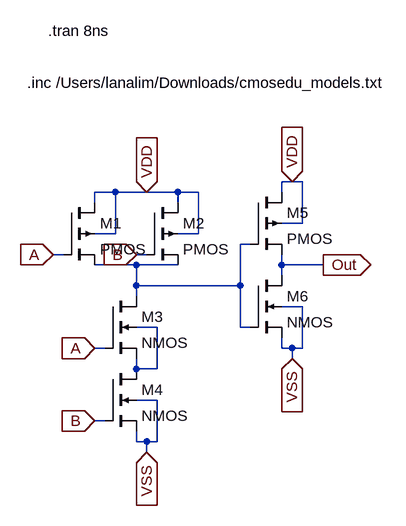
[diagram p0: schematic cmos_and.asc]
cmos_and.asc, the LTspice schematic file:
Version 4
SHEET 1 1408 680
WIRE 608 144 592 144
WIRE 624 144 608 144
WIRE 336 160 304 160
WIRE 384 160 336 160
WIRE 432 160 384 160
WIRE 464 160 432 160
WIRE 592 160 592 144
WIRE 304 176 304 160
WIRE 432 176 432 160
WIRE 624 208 624 144
WIRE 624 208 592 208
WIRE 336 224 336 160
WIRE 336 224 304 224
WIRE 464 224 464 160
WIRE 464 224 432 224
WIRE 544 240 528 240
WIRE 256 256 240 256
WIRE 384 256 368 256
WIRE 368 272 304 272
WIRE 432 272 368 272
WIRE 592 272 592 256
WIRE 656 272 592 272
WIRE 592 288 592 272
WIRE 368 304 368 272
WIRE 528 304 528 240
WIRE 528 304 368 304
WIRE 368 320 368 304
WIRE 624 336 592 336
WIRE 400 368 368 368
WIRE 528 368 528 304
WIRE 544 368 528 368
WIRE 320 400 304 400
WIRE 592 400 592 384
WIRE 608 400 592 400
WIRE 624 400 624 336
WIRE 624 400 608 400
WIRE 608 416 608 400
WIRE 368 432 368 416
WIRE 400 432 400 368
WIRE 400 432 368 432
WIRE 400 480 368 480
WIRE 320 512 304 512
WIRE 368 544 368 528
WIRE 384 544 368 544
WIRE 400 544 400 480
WIRE 400 544 384 544
WIRE 384 560 384 544
FLAG 384 160 VDD
IOPIN 384 160 In
FLAG 240 256 A
IOPIN 240 256 In
FLAG 368 256 B
IOPIN 368 256 In
FLAG 304 400 A
IOPIN 304 400 In
FLAG 304 512 B
IOPIN 304 512 In
FLAG 384 560 VSS
IOPIN 384 560 In
FLAG 608 416 VSS
IOPIN 608 416 In
FLAG 608 144 VDD
IOPIN 608 144 In
FLAG 656 272 Out
IOPIN 656 272 Out
SYMBOL pmos4 256 176 R0
SYMATTR InstName M1
SYMATTR Value2 l=1e-7 w=3e-7
SYMBOL pmos4 384 176 R0
SYMATTR InstName M2
SYMATTR Value2 l=1e-7 w=3e-7
SYMBOL nmos4 320 320 R0
SYMATTR InstName M3
SYMATTR Value2 l=1e-7 w=4e-7
SYMBOL nmos4 320 432 R0
SYMATTR InstName M4
SYMATTR Value2 l=1e-7 w=4e-7
SYMBOL pmos4 544 160 R0
SYMATTR InstName M5
SYMATTR Value2 l=1e-7 w=3e-7
SYMBOL nmos4 544 288 R0
SYMATTR InstName M6
SYMATTR Value2 l=1e-7 w=2e-7
TEXT 200 -8 Left 2 !.inc /Users/lanalim/Downloads/cmosedu_models.txt
TEXT 232 -88 Left 2 !.tran 8ns

The netlist it stands for:
* cmos_and.asc
M1 VDD A N001 VDD PMOS l=1e-7 w=3e-7
M2 VDD B N001 VDD PMOS l=1e-7 w=3e-7
M3 N001 A N002 N002 NMOS l=1e-7 w=4e-7
M4 N002 B VSS VSS NMOS l=1e-7 w=4e-7
M5 VDD N001 Out VDD PMOS l=1e-7 w=3e-7
M6 Out N001 VSS VSS NMOS l=1e-7 w=2e-7
.model NMOS NMOS
.model PMOS PMOS
.lib standard.mos
.inc /Users/lanalim/Downloads/cmosedu_models.txt
.tran 8ns
.backanno
.end